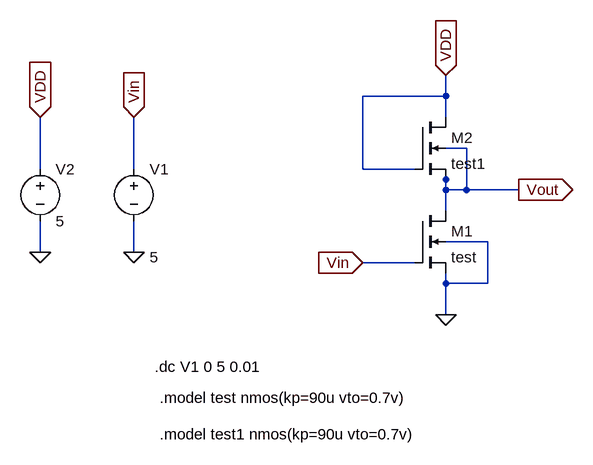
[diagram p0: schematic CSN_NMOSDiodegain.asc]
CSN_NMOSDiodegain.asc, the LTspice schematic file:
Version 4
SHEET 1 996 680
WIRE 624 -16 624 -48
WIRE 624 -16 496 -16
WIRE 624 16 624 -16
WIRE 656 64 624 64
WIRE 0 96 0 16
WIRE 144 96 144 16
WIRE 496 96 496 -16
WIRE 576 96 496 96
WIRE 624 112 624 96
WIRE 624 128 624 112
WIRE 656 128 656 64
WIRE 656 128 624 128
WIRE 736 128 656 128
WIRE 624 160 624 128
WIRE 688 208 624 208
WIRE 0 224 0 176
WIRE 144 224 144 176
WIRE 576 240 496 240
WIRE 624 272 624 256
WIRE 688 272 688 208
WIRE 688 272 624 272
WIRE 624 320 624 272
FLAG 0 224 0
FLAG 144 224 0
FLAG 624 320 0
FLAG 0 16 VDD
IOPIN 0 16 In
FLAG 624 -48 VDD
IOPIN 624 -48 In
FLAG 736 128 Vout
IOPIN 736 128 Out
FLAG 144 16 Vin
IOPIN 144 16 In
FLAG 496 240 Vin
IOPIN 496 240 In
SYMBOL voltage 144 80 R0
WINDOW 3 24 152 Left 2
WINDOW 123 24 124 Left 2
WINDOW 39 0 0 Left 0
SYMATTR Value 5
SYMATTR InstName V1
SYMBOL voltage 0 80 R0
WINDOW 123 0 0 Left 0
WINDOW 39 0 0 Left 0
SYMATTR InstName V2
SYMATTR Value 5
SYMBOL nmos4 576 160 R0
SYMATTR InstName M1
SYMATTR Value test
SYMATTR Value2 l=1u w=3u
SYMBOL nmos4 576 16 R0
SYMATTR InstName M2
SYMATTR Value test1
SYMATTR Value2 l=1u w=1u
TEXT 176 400 Left 2 !.dc V1 0 5 0.01
TEXT 184 448 Left 2 !.model test nmos(kp=90u vto=0.7v)
TEXT 184 504 Left 2 !.model test1 nmos(kp=90u vto=0.7v)

The netlist it stands for:
* CSN_NMOSDiodegain.asc
V1 Vin 0 5
V2 VDD 0 5
M1 Vout Vin 0 0 test l=1u w=3u
M2 VDD VDD Vout Vout test1 l=1u w=1u
.model NMOS NMOS
.model PMOS PMOS
.lib standard.mos
.dc V1 0 5 0.01
.model test nmos(kp=90u vto=0.7v)
.model test1 nmos(kp=90u vto=0.7v)
.backanno
.end